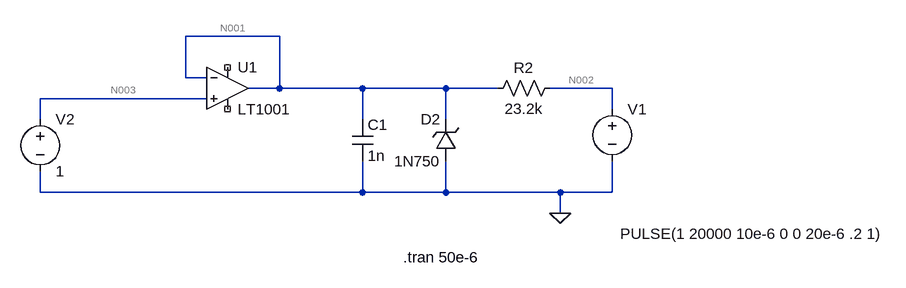
[diagram p0: schematic esd_analog_out.asc]
esd_analog_out.asc, the LTspice schematic file:
Version 4
SHEET 1 912 680
WIRE -272 32 -416 32
WIRE -416 96 -416 32
WIRE -384 96 -416 96
WIRE -272 112 -272 32
WIRE -272 112 -320 112
WIRE -144 112 -272 112
WIRE -16 112 -144 112
WIRE 64 112 -16 112
WIRE 240 112 144 112
WIRE -384 128 -640 128
WIRE 240 144 240 112
WIRE -640 160 -640 128
WIRE -144 160 -144 112
WIRE -16 160 -16 112
WIRE -640 272 -640 240
WIRE -144 272 -144 224
WIRE -144 272 -640 272
WIRE -16 272 -16 224
WIRE -16 272 -144 272
WIRE 160 272 -16 272
WIRE 240 272 240 224
WIRE 240 272 160 272
WIRE 160 304 160 272
FLAG 160 304 0
SYMBOL voltage 240 128 R0
WINDOW 3 12 208 Left 2
WINDOW 123 0 0 Left 2
WINDOW 39 0 0 Left 2
SYMATTR InstName V1
SYMATTR Value PULSE(1 20000 10e-6 0 0 20e-6 .2 1)
SYMBOL res 160 96 R90
WINDOW 0 0 56 VBottom 2
WINDOW 3 32 56 VTop 2
SYMATTR InstName R2
SYMATTR Value 23.2k
SYMBOL zener 0 224 R180
WINDOW 0 24 64 Left 2
WINDOW 3 24 0 Left 2
SYMATTR InstName D2
SYMATTR Value 1N750
SYMATTR Description Diode
SYMATTR Type diode
SYMBOL voltage -640 144 R0
WINDOW 123 0 0 Left 2
WINDOW 39 0 0 Left 2
SYMATTR InstName V2
SYMATTR Value 1
SYMBOL cap -160 160 R0
SYMATTR InstName C1
SYMATTR Value 1n
SYMBOL Opamps\\LT1001 -352 48 R0
SYMATTR InstName U1
TEXT -82 372 Left 2 !.tran 50e-6

The netlist it stands for:
* esd_analog_out.asc
V1 N002 0 PULSE(1 20000 10e-6 0 0 20e-6 .2 1)
R2 N002 N001 23.2k
D2 0 N001 1N750
V2 N003 0 1
C1 N001 0 1n
XU1 N003 N001 NC_01 NC_02 N001 LT1001  ; pins In+ In- V+ V- OUT
.model D D
.lib standard.dio
.tran 50e-6
.lib LTC.lib
.backanno
.end

* Results of the author's LTspice run, read from the files saved beside the schematic
* Operating Point, zero values left out:
*   V(n002) = 1 V
*   V(n001) = 1 V
*   V(n003) = 1 V
*   I(D2) = -133.8 nA
*   I(R2) = -16.06 nA
*   I(V2) = 5.231 pA
*   I(V1) = 16.06 nA
*   Ix(u1:1) = -5.231 pA
*   Ix(u1:2) = 4.829 pA
*   Ix(u1:5) = -149.8 nA
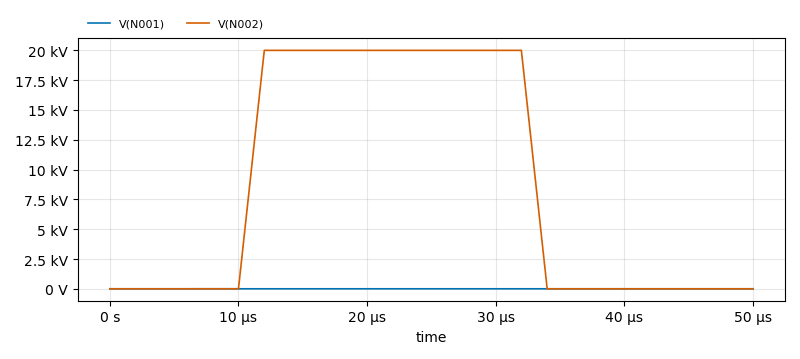
[diagram p1: Transient Analysis of esd_analog_out.asc, plotted from the saved traces]
* Transient Analysis, 1 run:
*   V(N001): min 1 V, max 5.08 V, average 3.342 V, rms 3.759 V, last 1.795 V
*   V(N002): min 1 V, max 20 kV, average 8.801 kV, rms 13.07 kV, last 1 V